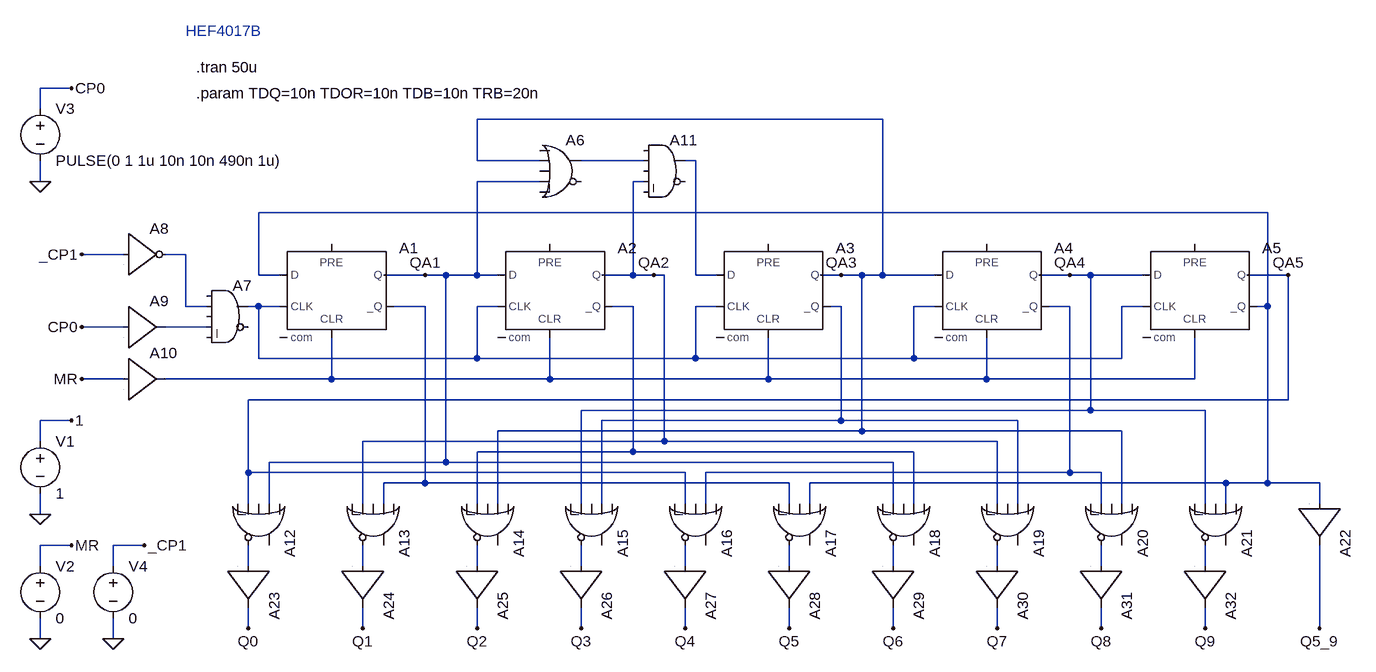
[diagram p0: schematic hef4017.asc]
hef4017.asc, the LTspice schematic file:
Version 4
SHEET 1 1776 864
WIRE -192 -176 -240 -176
WIRE -240 -144 -240 -176
WIRE 1056 -128 432 -128
WIRE 432 -64 432 -128
WIRE 528 -64 432 -64
WIRE 688 -64 592 -64
WIRE 768 -64 752 -64
WIRE -240 -32 -240 -64
WIRE 528 -32 432 -32
WIRE 688 -32 672 -32
WIRE 1648 16 96 16
WIRE -112 80 -176 80
WIRE -16 80 -48 80
WIRE 96 112 96 16
WIRE 128 112 96 112
WIRE 352 112 288 112
WIRE 384 112 352 112
WIRE 432 112 432 -32
WIRE 432 112 384 112
WIRE 464 112 432 112
WIRE 672 112 672 -32
WIRE 672 112 624 112
WIRE 704 112 672 112
WIRE 720 112 704 112
WIRE 768 112 768 -64
WIRE 800 112 768 112
WIRE 992 112 960 112
WIRE 1024 112 992 112
WIRE 1056 112 1056 -128
WIRE 1056 112 1024 112
WIRE 1136 112 1056 112
WIRE 1344 112 1296 112
WIRE 1376 112 1344 112
WIRE 1456 112 1376 112
WIRE 1680 112 1616 112
WIRE -16 160 -16 80
WIRE 16 160 -16 160
WIRE 96 160 80 160
WIRE 128 160 96 160
WIRE 352 160 304 160
WIRE 464 160 432 160
WIRE 672 160 640 160
WIRE 800 160 768 160
WIRE 992 160 976 160
WIRE 1136 160 1104 160
WIRE 1344 160 1312 160
WIRE 1456 160 1424 160
WIRE 1648 160 1648 16
WIRE 1648 160 1632 160
WIRE -112 192 -176 192
WIRE 16 192 -48 192
WIRE 96 240 96 160
WIRE 432 240 432 160
WIRE 432 240 96 240
WIRE 768 240 768 160
WIRE 768 240 432 240
WIRE 1104 240 1104 160
WIRE 1104 240 768 240
WIRE 1424 240 1424 160
WIRE 1424 240 1104 240
WIRE -112 272 -176 272
WIRE 208 272 208 208
WIRE 208 272 -48 272
WIRE 544 272 544 208
WIRE 544 272 208 272
WIRE 880 272 880 208
WIRE 880 272 544 272
WIRE 1216 272 1216 208
WIRE 1216 272 880 272
WIRE 1536 272 1536 208
WIRE 1536 272 1216 272
WIRE 1680 304 1680 112
WIRE 1680 304 80 304
WIRE 1376 320 1376 112
WIRE 1376 320 592 320
WIRE 1552 320 1376 320
WIRE -192 336 -240 336
WIRE 992 336 992 160
WIRE 992 336 624 336
WIRE 1264 336 992 336
WIRE 1024 352 1024 112
WIRE 1024 352 464 352
WIRE 1424 352 1024 352
WIRE -240 368 -240 336
WIRE 720 368 720 112
WIRE 720 368 256 368
WIRE 1232 368 720 368
WIRE 672 384 672 160
WIRE 672 384 432 384
WIRE 1104 384 672 384
WIRE 384 400 384 112
WIRE 384 400 112 400
WIRE 1072 400 384 400
WIRE 80 416 80 304
WIRE 752 416 80 416
WIRE 1344 416 1344 160
WIRE 1344 416 784 416
WIRE 1392 416 1344 416
WIRE 352 432 352 160
WIRE 352 432 288 432
WIRE 912 432 352 432
WIRE 1584 432 944 432
WIRE 1648 432 1648 160
WIRE 1648 432 1584 432
WIRE 1728 432 1648 432
WIRE 80 464 80 416
WIRE 112 464 112 400
WIRE 256 464 256 368
WIRE 288 464 288 432
WIRE 432 464 432 384
WIRE 464 464 464 352
WIRE 592 464 592 320
WIRE 624 464 624 336
WIRE 752 464 752 416
WIRE 784 464 784 416
WIRE 912 464 912 432
WIRE 944 464 944 432
WIRE 1072 464 1072 400
WIRE 1104 464 1104 384
WIRE 1232 464 1232 368
WIRE 1264 464 1264 336
WIRE 1392 464 1392 416
WIRE 1424 464 1424 352
WIRE 1552 464 1552 320
WIRE 1584 464 1584 432
WIRE 1728 464 1728 432
WIRE -240 480 -240 448
WIRE -192 528 -240 528
WIRE -80 528 -128 528
WIRE -240 560 -240 528
WIRE -128 560 -128 528
WIRE 80 560 80 528
WIRE 256 560 256 528
WIRE 432 560 432 528
WIRE 592 560 592 528
WIRE 752 560 752 528
WIRE 912 560 912 528
WIRE 1072 560 1072 528
WIRE 1232 560 1232 528
WIRE 1392 560 1392 528
WIRE 1552 560 1552 528
WIRE 80 656 80 624
WIRE 256 656 256 624
WIRE 432 656 432 624
WIRE 592 656 592 624
WIRE 752 656 752 624
WIRE 912 656 912 624
WIRE 1072 656 1072 624
WIRE 1232 656 1232 624
WIRE 1392 656 1392 624
WIRE 1552 656 1552 624
WIRE 1728 656 1728 528
WIRE -240 672 -240 640
WIRE -128 672 -128 640
FLAG -176 272 MR
FLAG -176 192 CP0
FLAG -176 80 _CP1
FLAG 80 656 Q0
FLAG 256 656 Q1
FLAG 432 656 Q2
FLAG 592 656 Q3
FLAG 752 656 Q4
FLAG 912 656 Q5
FLAG 1072 656 Q6
FLAG 1232 656 Q7
FLAG 1392 656 Q8
FLAG 1552 656 Q9
FLAG 1728 656 Q5_9
FLAG -240 480 0
FLAG -240 672 0
FLAG -240 -32 0
FLAG -192 -176 CP0
FLAG -192 336 1
FLAG -192 528 MR
FLAG -128 672 0
FLAG -80 528 _CP1
FLAG 352 112 QA1
FLAG 704 112 QA2
FLAG 992 112 QA3
FLAG 1344 112 QA4
FLAG 1680 112 QA5
SYMBOL Digital\\dflop 208 64 R0
SYMATTR InstName A1
SYMATTR SpiceLine TD={TDQ}
SYMBOL Digital\\dflop 544 64 R0
SYMATTR InstName A2
SYMATTR SpiceLine TD={TDQ}
SYMBOL Digital\\dflop 880 64 R0
SYMATTR InstName A3
SYMATTR SpiceLine TD={TDQ}
SYMBOL Digital\\dflop 1216 64 R0
SYMATTR InstName A4
SYMATTR SpiceLine TD={TDQ}
SYMBOL Digital\\dflop 1536 64 R0
SYMATTR InstName A5
SYMATTR SpiceLine TD={TDQ}
SYMBOL Digital\\or 560 -112 R0
SYMATTR InstName A6
SYMATTR SpiceLine TD={TDB}
SYMBOL Digital\\and 48 112 R0
SYMATTR InstName A7
SYMATTR SpiceLine TD={TDB}
SYMBOL Digital\\inv -112 16 R0
SYMATTR InstName A8
SYMATTR SpiceLine TD={TDB}
SYMBOL Digital\\buf1 -112 128 R0
SYMATTR InstName A9
SYMATTR SpiceLine TD={TDB}
SYMBOL Digital\\buf1 -112 208 R0
SYMATTR InstName A10
SYMATTR SpiceLine TD={TDB}
SYMBOL Digital\\and 720 -112 R0
SYMATTR InstName A11
SYMATTR SpiceLine TD={TDB}
SYMBOL Digital\\or 160 496 R90
SYMATTR InstName A12
SYMATTR SpiceLine TD={TDOR}
SYMBOL Digital\\or 336 496 R90
SYMATTR InstName A13
SYMATTR SpiceLine TD={TDOR}
SYMBOL Digital\\or 512 496 R90
SYMATTR InstName A14
SYMATTR SpiceLine TD={TDOR}
SYMBOL Digital\\or 672 496 R90
SYMATTR InstName A15
SYMATTR SpiceLine TD={TDOR}
SYMBOL Digital\\or 832 496 R90
SYMATTR InstName A16
SYMATTR SpiceLine TD={TDOR}
SYMBOL Digital\\or 992 496 R90
SYMATTR InstName A17
SYMATTR SpiceLine TD={TDOR}
SYMBOL Digital\\or 1152 496 R90
SYMATTR InstName A18
SYMATTR SpiceLine TD={TDOR}
SYMBOL Digital\\or 1312 496 R90
SYMATTR InstName A19
SYMATTR SpiceLine TD={TDOR}
SYMBOL Digital\\or 1472 496 R90
SYMATTR InstName A20
SYMATTR SpiceLine TD={TDOR}
SYMBOL Digital\\or 1632 496 R90
SYMATTR InstName A21
SYMATTR SpiceLine TD={TDOR}
SYMBOL Digital\\buf1 1792 464 R90
SYMATTR InstName A22
SYMATTR SpiceLine TD={TDB} TRISE={TRB}
SYMBOL Digital\\buf1 144 560 R90
SYMATTR InstName A23
SYMATTR SpiceLine TD={TDB} TRISE={TRB}
SYMBOL Digital\\buf1 320 560 R90
SYMATTR InstName A24
SYMATTR SpiceLine TD={TDB} TRISE={TRB}
SYMBOL Digital\\buf1 496 560 R90
SYMATTR InstName A25
SYMATTR SpiceLine TD={TDB} TRISE={TRB}
SYMBOL Digital\\buf1 656 560 R90
SYMATTR InstName A26
SYMATTR SpiceLine TD={TDB} TRISE={TRB}
SYMBOL Digital\\buf1 816 560 R90
SYMATTR InstName A27
SYMATTR SpiceLine TD={TDB} TRISE={TRB}
SYMBOL Digital\\buf1 976 560 R90
SYMATTR InstName A28
SYMATTR SpiceLine TD={TDB} TRISE={TRB}
SYMBOL Digital\\buf1 1136 560 R90
SYMATTR InstName A29
SYMATTR SpiceLine TD={TDB} TRISE={TRB}
SYMBOL Digital\\buf1 1296 560 R90
SYMATTR InstName A30
SYMATTR SpiceLine TD={TDB} TRISE={TRB}
SYMBOL Digital\\buf1 1456 560 R90
SYMATTR InstName A31
SYMATTR SpiceLine TD={TDB} TRISE={TRB}
SYMBOL Digital\\buf1 1616 560 R90
SYMATTR InstName A32
SYMATTR SpiceLine TD={TDB} TRISE={TRB}
SYMBOL voltage -240 352 R0
SYMATTR InstName V1
SYMATTR Value 1
SYMBOL voltage -240 544 R0
SYMATTR InstName V2
SYMATTR Value 0
SYMBOL voltage -240 -160 R0
WINDOW 123 0 0 Left 0
WINDOW 39 0 0 Left 0
SYMATTR InstName V3
SYMATTR Value PULSE(0 1 1u 10n 10n 490n 1u)
SYMBOL voltage -128 544 R0
SYMATTR InstName V4
SYMATTR Value 0
TEXT 0 -168 Left 0 !.param TDQ=10n TDOR=10n TDB=10n TRB=20n
TEXT 0 -208 Left 0 !.tran 50u
TEXT -16 -264 Left 0 ;HEF4017B

The netlist it stands for:
* hef4017.asc
A1 N003 0 N005 0 N011 N006 QA1 0 DFLOP TD={TDQ}
A2 QA1 0 N005 0 N011 N007 QA2 0 DFLOP TD={TDQ}
A3 N002 0 N005 0 N011 N008 QA3 0 DFLOP TD={TDQ}
A4 QA3 0 N005 0 N011 N009 QA4 0 DFLOP TD={TDQ}
A5 QA4 0 N005 0 N011 N003 QA5 0 DFLOP TD={TDQ}
A6 0 QA3 0 QA1 0 0 N001 0 OR TD={TDB}
A7 0 N004 0 N010 0 0 N005 0 AND TD={TDB}
A8 _CP1 0 0 0 0 N004 0 0 BUF TD={TDB}
A9 CP0 0 0 0 0 0 N010 0 BUF TD={TDB}
A10 MR 0 0 0 0 0 N011 0 BUF TD={TDB}
A11 0 N001 0 QA2 0 0 N002 0 AND TD={TDB}
A12 0 QA1 0 QA5 0 N012 0 0 OR TD={TDOR}
A13 0 N006 0 QA2 0 N013 0 0 OR TD={TDOR}
A14 0 QA3 0 N007 0 N014 0 0 OR TD={TDOR}
A15 0 N008 0 QA4 0 N015 0 0 OR TD={TDOR}
A16 0 N009 0 QA5 0 N016 0 0 OR TD={TDOR}
A17 0 N003 0 N006 0 N017 0 0 OR TD={TDOR}
A18 0 N007 0 QA1 0 N018 0 0 OR TD={TDOR}
A19 0 N008 0 QA2 0 N019 0 0 OR TD={TDOR}
A20 0 QA3 0 N009 0 N020 0 0 OR TD={TDOR}
A21 0 N003 0 QA4 0 N021 0 0 OR TD={TDOR}
A22 N003 0 0 0 0 0 Q5_9 0 BUF TD={TDB} TRISE={TRB}
A23 N012 0 0 0 0 0 Q0 0 BUF TD={TDB} TRISE={TRB}
A24 N013 0 0 0 0 0 Q1 0 BUF TD={TDB} TRISE={TRB}
A25 N014 0 0 0 0 0 Q2 0 BUF TD={TDB} TRISE={TRB}
A26 N015 0 0 0 0 0 Q3 0 BUF TD={TDB} TRISE={TRB}
A27 N016 0 0 0 0 0 Q4 0 BUF TD={TDB} TRISE={TRB}
A28 N017 0 0 0 0 0 Q5 0 BUF TD={TDB} TRISE={TRB}
A29 N018 0 0 0 0 0 Q6 0 BUF TD={TDB} TRISE={TRB}
A30 N019 0 0 0 0 0 Q7 0 BUF TD={TDB} TRISE={TRB}
A31 N020 0 0 0 0 0 Q8 0 BUF TD={TDB} TRISE={TRB}
A32 N021 0 0 0 0 0 Q9 0 BUF TD={TDB} TRISE={TRB}
V1 1 0 1
V2 MR 0 0
V3 CP0 0 PULSE(0 1 1u 10n 10n 490n 1u)
V4 _CP1 0 0
.param TDQ=10n TDOR=10n TDB=10n TRB=20n
.tran 50u
* HEF4017B
.backanno
.end